# Altium schematic sheet var_04_scheme.SchDoc
size A4; SheetNumber: 4; SheetTotal: 10
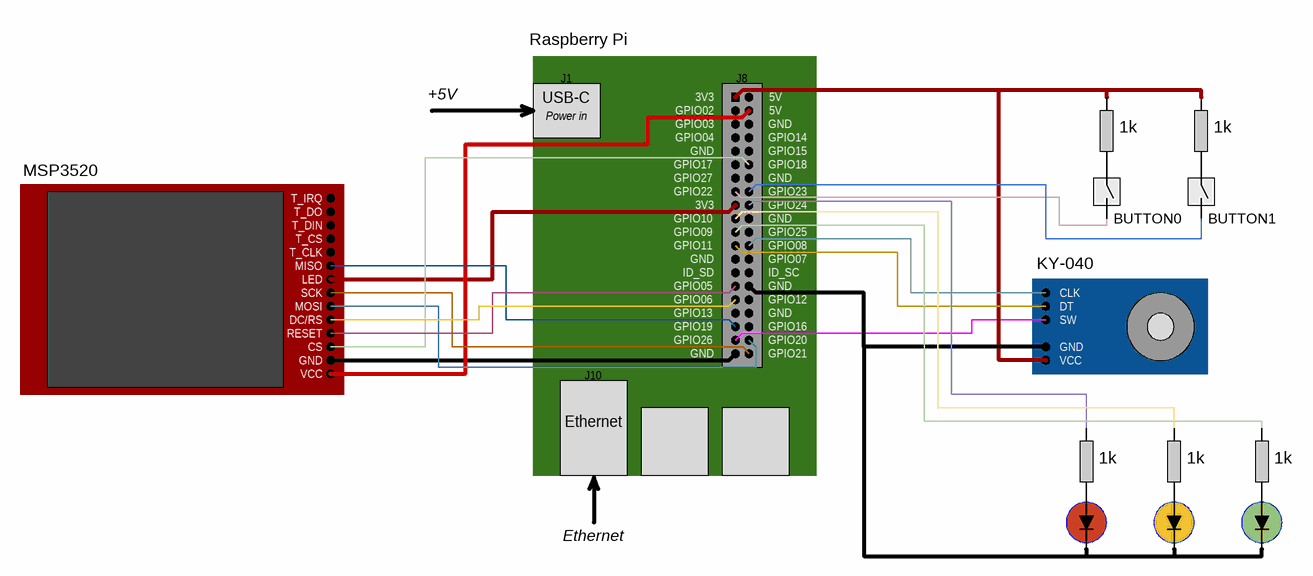
[diagram p0: var_04_scheme.SchDoc]

## Notes on the sheet
- +5V
- Raspberry Pi
- USB-C
- J1
- 3V3
- J8
- 5V
- MSP3520
- Power in
- GPIO17
- GPIO02
- GPIO03
- GPIO04
- GND
- GPIO14
- GPIO15
- GPIO18
- 1k
- T_IRQ
- T_DO
- T_DIN
- T_CS
- GPIO27
- GPIO22
- GPIO09
- GPIO10
- GPIO23
- GPIO24
- GPIO25
- BUTTON0
- BUTTON1
- T_CLK
- SCK
- LED
- MISO
- GPIO11
- GPIO05
- GPIO06
- ID_SD
- GPIO08
- GPIO07
- ID_SC
- GPIO12
- KY-040
- CLK
- VCC
- CS
- RESET
- DC/RS
- MOSI
- J10
- GPIO13
- GPIO19
- GPIO26
- GPIO16
- GPIO20
- GPIO21
- DT
- SW
- Ethernet